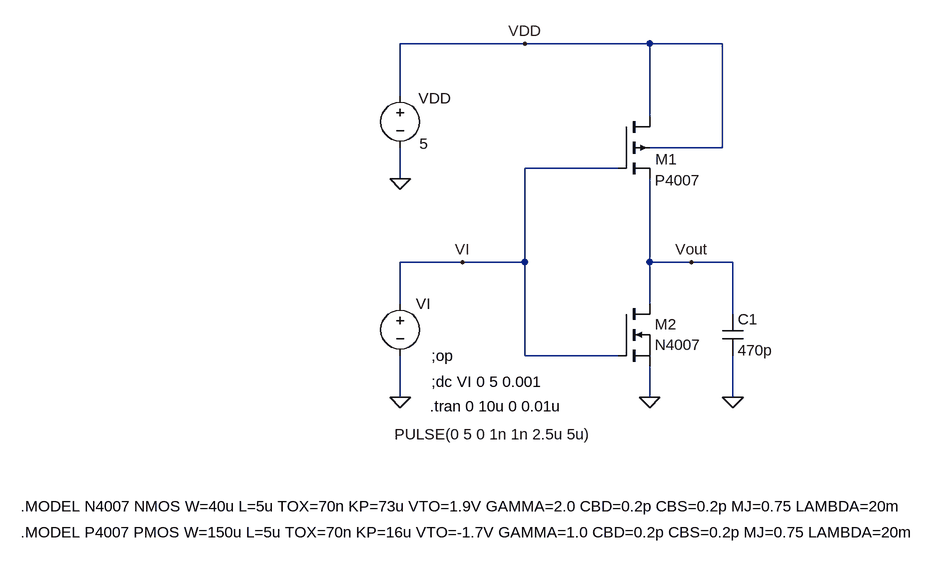
[diagram p0: schematic lab3.asc]
lab3.asc, the LTspice schematic file:
Version 4
SHEET 1 880 932
WIRE -288 -64 -480 -64
WIRE -96 -64 -288 -64
WIRE 16 -64 -96 -64
WIRE -480 16 -480 -64
WIRE -96 48 -96 -64
WIRE 16 96 16 -64
WIRE 16 96 -96 96
WIRE -144 128 -288 128
WIRE -480 144 -480 96
WIRE -384 272 -480 272
WIRE -288 272 -288 128
WIRE -288 272 -384 272
WIRE -96 272 -96 144
WIRE -32 272 -96 272
WIRE 32 272 -32 272
WIRE -480 336 -480 272
WIRE -96 336 -96 272
WIRE 32 352 32 272
WIRE -288 416 -288 272
WIRE -144 416 -288 416
WIRE -480 480 -480 416
WIRE -96 480 -96 432
WIRE 32 480 32 416
FLAG -480 480 0
FLAG -96 480 0
FLAG -480 144 0
FLAG -384 272 VI
FLAG -288 -64 VDD
FLAG -32 272 Vout
FLAG 32 480 0
SYMBOL voltage -480 320 R0
WINDOW 3 -9 217 Left 2
WINDOW 123 0 0 Left 0
WINDOW 39 0 0 Left 0
SYMATTR InstName VI
SYMATTR Value PULSE(0 5 0 1n 1n 2.5u 5u)
SYMBOL voltage -480 0 R0
WINDOW 0 28 20 Left 2
WINDOW 3 30 90 Left 2
WINDOW 123 0 0 Left 0
WINDOW 39 0 0 Left 0
SYMATTR InstName VDD
SYMATTR Value 5
SYMBOL nmos -144 336 R0
WINDOW 3 56 63 Left 2
SYMATTR InstName M2
SYMATTR Value N4007
SYMBOL pmos4 -144 48 R0
WINDOW 0 57 66 Left 2
WINDOW 3 56 98 Left 2
SYMATTR InstName M1
SYMATTR Value P4007
SYMBOL cap 16 352 R0
SYMATTR InstName C1
SYMATTR Value 470p
TEXT -1064 648 Left 2 !.MODEL N4007 NMOS W=40u L=5u TOX=70n KP=73u VTO=1.9V GAMMA=2.0 CBD=0.2p CBS=0.2p MJ=0.75 LAMBDA=20m
TEXT -1064 688 Left 2 !.MODEL P4007 PMOS W=150u L=5u TOX=70n KP=16u VTO=-1.7V GAMMA=1.0 CBD=0.2p CBS=0.2p MJ=0.75 LAMBDA=20m
TEXT -432 416 Left 2 !;op
TEXT -432 456 Left 2 !;dc VI 0 5 0.001
TEXT -434 494 Left 2 !.tran 0 10u 0 0.01u

The netlist it stands for:
* lab3.asc
VI VI 0 PULSE(0 5 0 1n 1n 2.5u 5u)
VDD VDD 0 5
M2 Vout VI 0 0 N4007
M1 VDD VI Vout VDD P4007
C1 Vout 0 470p
.model NMOS NMOS
.model PMOS PMOS
.lib standard.mos
.MODEL N4007 NMOS W=40u L=5u TOX=70n KP=73u VTO=1.9V GAMMA=2.0 CBD=0.2p CBS=0.2p MJ=0.75 LAMBDA=20m
.MODEL P4007 PMOS W=150u L=5u TOX=70n KP=16u VTO=-1.7V GAMMA=1.0 CBD=0.2p CBS=0.2p MJ=0.75 LAMBDA=20m
;op
;dc VI 0 5 0.001
.tran 0 10u 0 0.01u
.backanno
.end